# EAGLE design track charger (EAGLE 7.2.0)
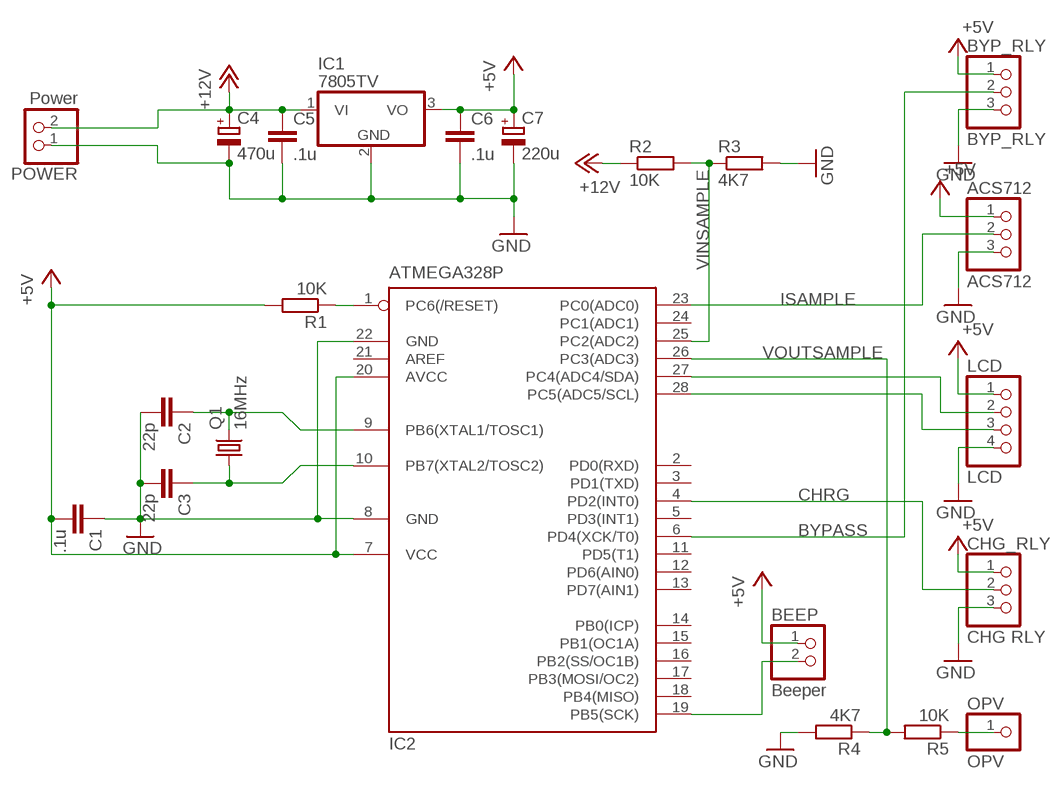
[diagram p0: schematic, sheet 1]

## Parts
ACS712  ACS712  PINHD-1X3  [1X03]
BEEP  Beeper  PINHD-1X2  [1X02]
BYP_RLY  BYP_RLY  PINHD-1X3  [1X03]
C1  .1u  C-EU025-024X044  [C025-024X044]
C2  22p  C-EU025-024X044  [C025-024X044]
C3  22p  C-EU025-024X044  [C025-024X044]
C4  470u  CPOL-EUE3.5-10  [E3,5-10]
C5  .1u  C-EU025-024X044  [C025-024X044]
C6  .1u  C-EU025-024X044  [C025-024X044]
C7  220u  CPOL-EUE2.5-7  [E2,5-7]
CHG_RLY  CHG RLY  PINHD-1X3  [1X03]
IC1  7805TV  [TO220V]
IC2  ATMEGA328P  MEGA8-P  [DIL28-3]
LCD  LCD  PINHD-1X4  [1X04]
OPV  OPV  PINHD-1X1  [1X01]
POWER  Power  PINHD-1X2  [1X02]
Q1  16MHz  CRYSTALHC18U-V  [HC18U-V]
R1  10K  R-EU_0204/7  [0204/7]
R2  10K  R-EU_0204/7  [0204/7]
R3  4K7  R-EU_0204/7  [0204/7]
R4  4K7  R-EU_0204/7  [0204/7]
R5  10K  R-EU_0204/7  [0204/7]

## Nets
+5V: ACS712.1 BEEP.1 BYP_RLY.1 C1.2 C6.1 C7.+ CHG_RLY.1 IC1.3(VO) IC2.7(VCC) IC2.20(AVCC) LCD.1 R1.2
+12V: C4.+ C5.1 IC1.1(VI) POWER.2 R2.1
BYPASS: BYP_RLY.2 IC2.6(PD4(XCK/T0))
CHRG: CHG_RLY.2 IC2.4(PD2(INT0))
GND: ACS712.3 BYP_RLY.3 C1.1 C2.2 C3.2 C4.- C5.2 C6.2 C7.- CHG_RLY.3 IC1.2(GND) IC2.8(GND) IC2.22(GND) LCD.4 POWER.1 R3.2 R4.2
ISAMPLE: ACS712.2 IC2.23(PC0(ADC0))
N$1: IC2.27(PC4(ADC4/SDA)) LCD.2
N$2: IC2.28(PC5(ADC5/SCL)) LCD.3
N$7: OPV.1 R5.1
N$10: C3.1 IC2.10(PB7(XTAL2/TOSC2)) Q1.1
N$13: BEEP.2 IC2.19(PB5(SCK))
N$16: C2.1 IC2.9(PB6(XTAL1/TOSC1)) Q1.2
N$18: IC2.1(PC6(/RESET)) R1.1
VINSAMPLE: IC2.25(PC2(ADC2)) R2.2 R3.1
VOUTSAMPLE: IC2.26(PC3(ADC3)) R4.1 R5.2
Unconnected: IC2.2(PD0(RXD)) IC2.3(PD1(TXD)) IC2.5(PD3(INT1)) IC2.11(PD5(T1)) IC2.12(PD6(AIN0)) IC2.13(PD7(AIN1)) IC2.14(PB0(ICP)) IC2.15(PB1(OC1A)) IC2.16(PB2(SS/OC1B)) IC2.17(PB3(MOSI/OC2)) IC2.18(PB4(MISO)) IC2.21(AREF) IC2.24(PC1(ADC1))

## Library data of the parts
ACS712 BYP_RLY CHG_RLY = pinhead:PINHD-1X3: PIN HEADER
BEEP POWER = pinhead:PINHD-1X2: PIN HEADER
C1-C3 C5 C6 = resistor:C-EU: CAPACITOR, European symbol
C4 C7 = resistor:CPOL-EU: POLARIZED CAPACITOR, European symbol
IC1 = linear:78*: Positive VOLTAGE REGULATOR Source: http://cache.national.com/ds/LM/LM78L05.pdf http://www.fairchildsemi.com/ds/LM/LM7805.pdf
IC2 = atmel:MEGA8-P: MICROCONTROLLER 8 Kbytes FLASH, 1 kbytes SRAM, 512 bytes EEPROM, USART, 4-channel 10 bit ADC, 2-channel 8 bit ADC Pin compatible with Atmega48, ATMega88, ATMega168 Source: avr.lbr; OC_FARNELL: unknown; OC_NEWARK: unknown
LCD = pinhead:PINHD-1X4: PIN HEADER
OPV = pinhead:PINHD-1X1: PIN HEADER
Q1 = crystal:CRYSTAL: CRYSTAL; OC_FARNELL: unknown; OC_NEWARK: unknown
R1-R5 = resistor:R-EU_: RESISTOR, European symbol

## Board
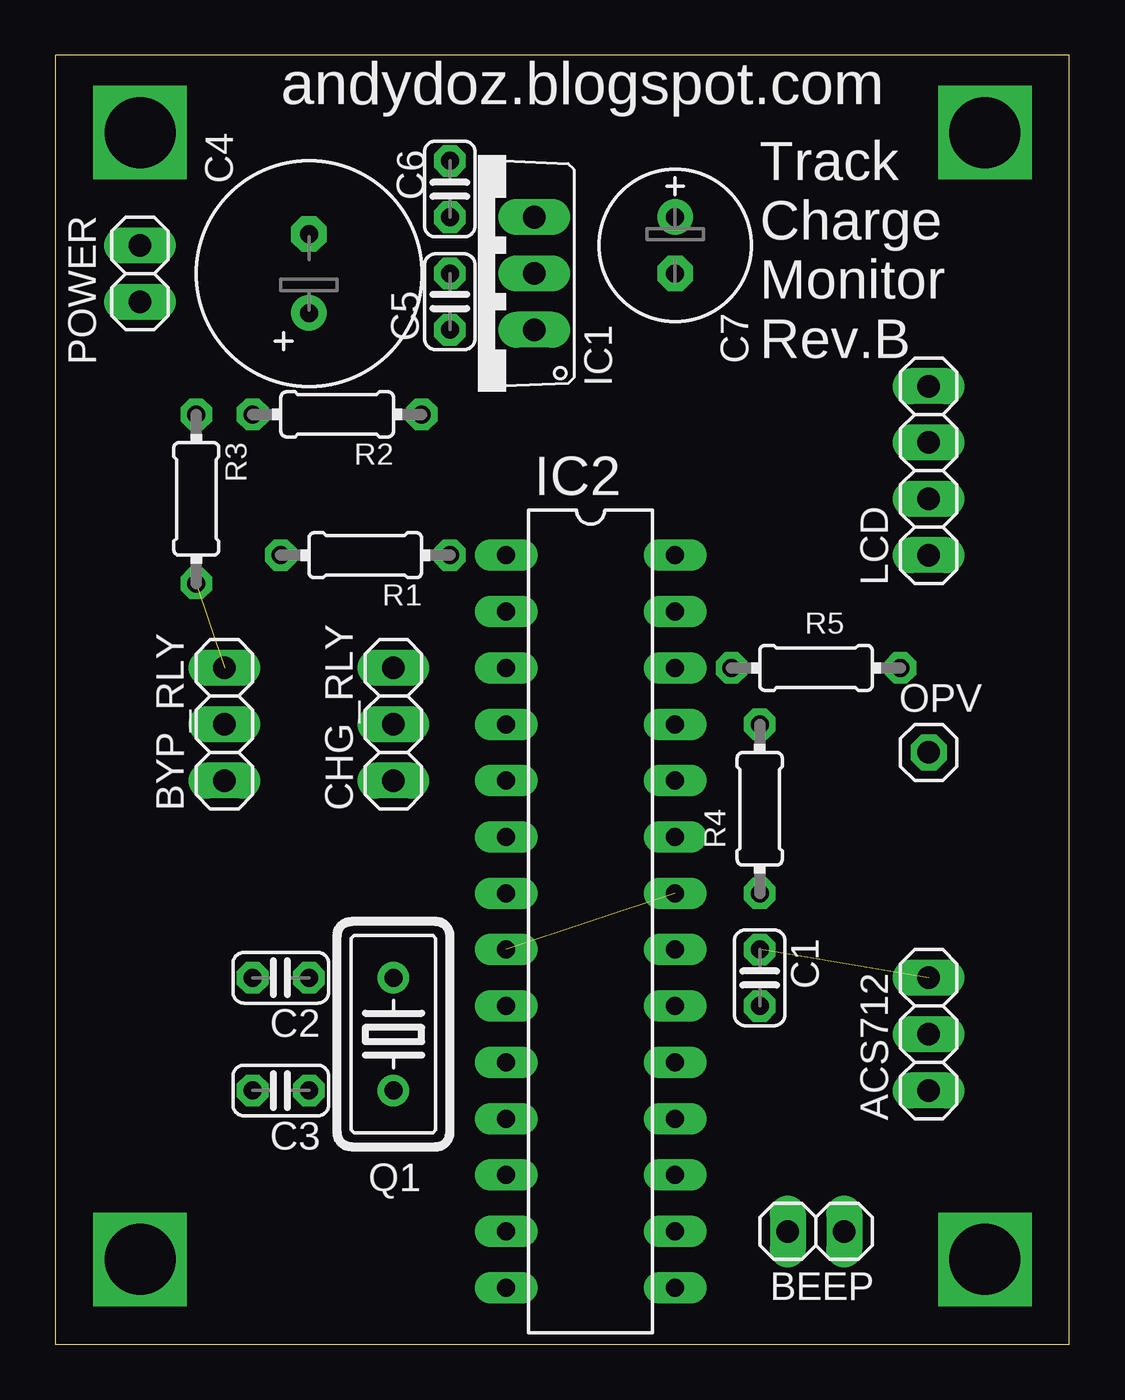
[diagram p1: board, top side]
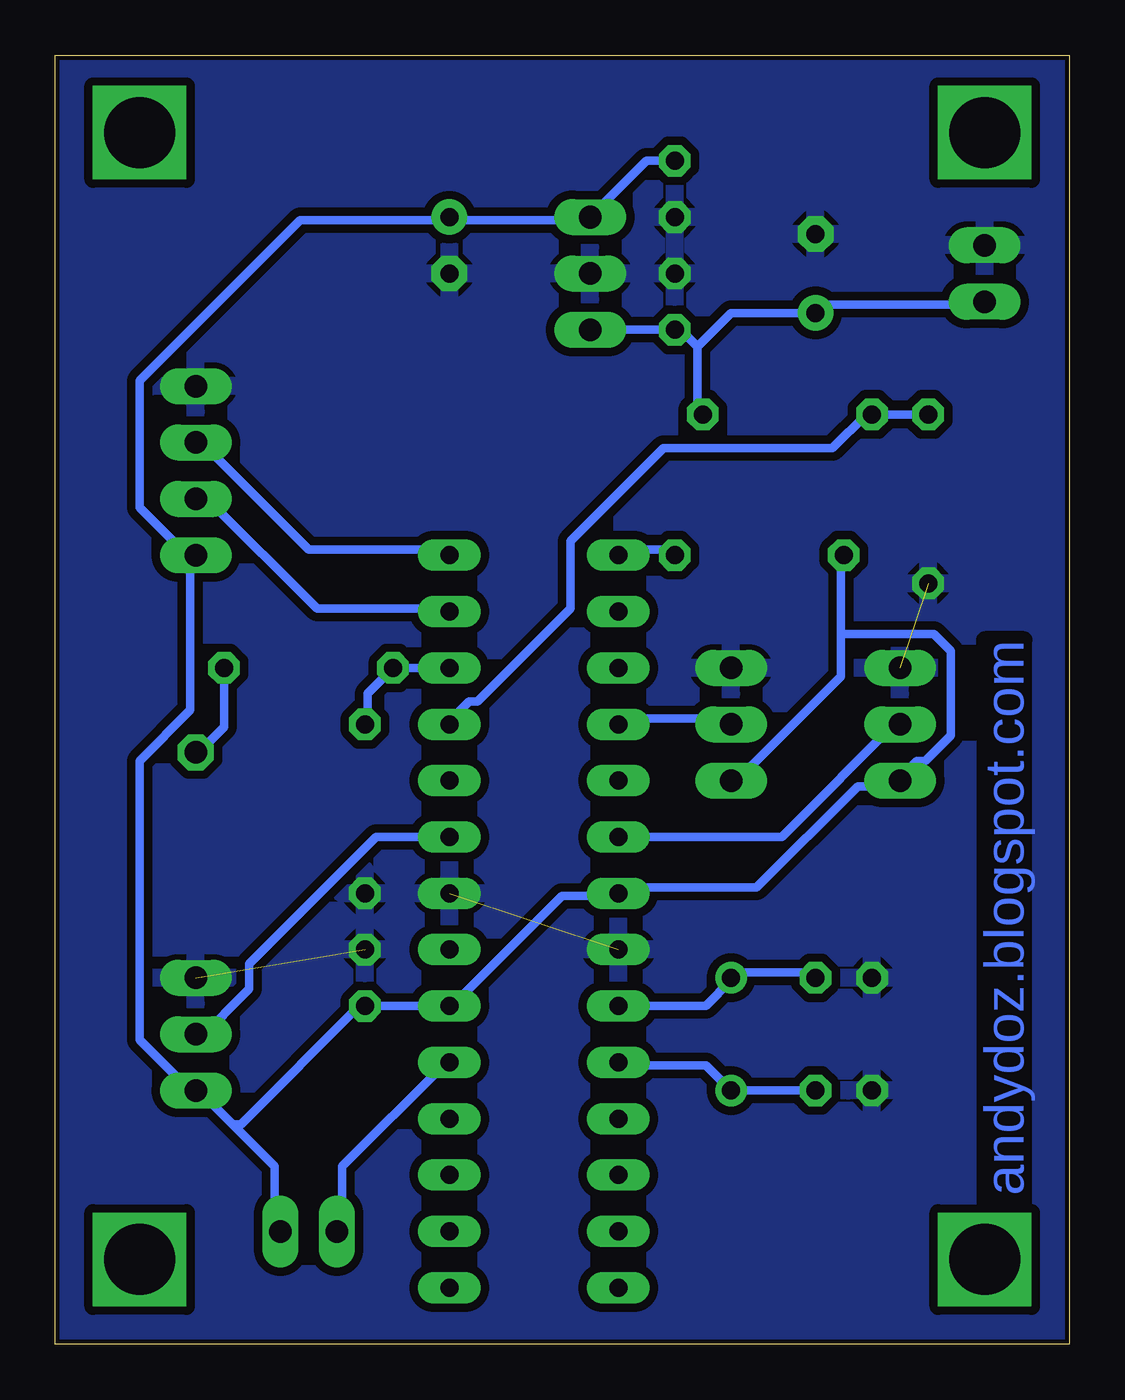
[diagram p2: board, bottom side, seen from below]

Size 45.7 x 58.09 mm. Coordinates in mm from the lower left corner, seen from the top.
Outline: 0,0 45.7,0 45.7,58.09 0,58.09 0,0
Copper layers (1*16): Top 0.035mm / dielectric 1.5mm / Bottom 0.035mm
Design rules "Doz1": minimum track width 15mil, minimum drill 20mil, track to track 15mil, track to pad 15mil, pad to pad 15mil, via to via 15mil, smd to smd 15mil, copper to edge 8mil, drill to drill 8mil, minimum pad ring 12mil, minimum via ring 10mil, stop-mask expansion 4mil, vias tented up to drill 20mil, thermal gap 10mil

### Footprints (pad centres in the part's own frame; a part is rotated, then mirrored left to right if it is on the bottom)
1X03 = drill 1.016 long: 1 -2.54,0; 2 0,0; 3 2.54,0
1X02 = drill 1.016 long: 1 -1.27,0; 2 1.27,0
C025-024X044 = drill 0.813 octagon: 1 -1.27,0; 2 1.27,0
E3,5-10 = drill 0.813 pad 1.6: + -1.778,0 | drill 0.813 pad 1.6 octagon: - 1.778,0
E2,5-7 = drill 0.813 pad 1.6: + -1.27,0 | drill 0.813 pad 1.6 octagon: - 1.27,0
TO220V = drill 1.016 long: 1 -2.54,-2.54; 2 0,-2.54; 3 2.54,-2.54
DIL28-3 = drill 0.813 long: 1 -16.51,-3.81; 2 -13.97,-3.81; 3 -11.43,-3.81; 4 -8.89,-3.81; 5 -6.35,-3.81; 6 -3.81,-3.81; 7 -1.27,-3.81; 8 1.27,-3.81; 9 3.81,-3.81; 10 6.35,-3.81; 11 8.89,-3.81; 12 11.43,-3.81; 13 13.97,-3.81; 14 16.51,-3.81; 15 16.51,3.81; 16 13.97,3.81; 17 11.43,3.81; 18 8.89,3.81; 19 6.35,3.81; 20 3.81,3.81; 21 1.27,3.81; 22 -1.27,3.81; 23 -3.81,3.81; 24 -6.35,3.81; 25 -8.89,3.81; 26 -11.43,3.81; 27 -13.97,3.81; 28 -16.51,3.81
1X04 = drill 1.016 long: 1 -3.81,0; 2 -1.27,0; 3 1.27,0; 4 3.81,0
1X01 = drill 1.016 octagon: 1 0,0
HC18U-V = drill 0.813: 1 -2.54,0; 2 2.54,0
0204/7 = drill 0.813 octagon: 1 -3.81,0; 2 3.81,0

### Placement (x,y rotation side)
ACS712  39.37,13.97 90 top
BEEP  34.29,5.08 180 top
BYP_RLY  7.62,27.94 90 top
C1  31.75,16.51 270 top
C2  10.16,16.51 180 top
C3  10.16,11.43 180 top
C4  11.43,48.26 90 top
C5  17.78,46.99 90 top
C6  17.78,52.07 270 top
C7  27.94,49.53 270 top
CHG_RLY  15.24,27.94 90 top
IC1  19.05,48.26 90 top
IC2  24.13,19.05 270 top
LCD  39.37,39.37 90 top
OPV  39.37,26.67 0 top
POWER  3.81,48.26 270 top
Q1  15.24,13.97 90 top
R1  13.97,35.56 180 top
R2  12.7,41.91 180 top
R3  6.35,38.1 270 top
R4  31.75,24.13 270 top
R5  34.29,30.48 180 top

### Tracks (layer width: path | path; a pad name or v marks a point on that pad's centre or on a via)
+5V
  Bottom 0.381: 10.29,32 10.29,30.1 15.24,25.15 CHG_RLY.1 | 10.29,32 10.29,35.43 R1.2 | 10.29,32 6.1,32 5.33,31.24 5.33,27.43 6.48,26.29 6.86,26.29 7.62,25.53 BYP_RLY.1 7.62,25.15 9.53,25.15 14.1,20.57 20.19,20.57 IC2.7 20.57,20.19 22.86,20.19 27.81,15.24 IC2.20 C1.2 32,15.24 37.34,9.91 37.72,9.91 | C6.1 19.05,53.34 IC1.3 21.72,50.67 27.81,50.67 C7.+ 28.19,50.67 34.67,50.67 41.91,43.43 41.91,37.72 39.62,35.43 | 37.72,9.91 39.24,11.43 ACS712.1 39.62,11.43 41.91,13.72 41.91,26.29 39.62,28.58 39.62,35.43 | 37.72,9.91 35.81,8 35.81,5.33 BEEP.1 | 39.62,35.43 LCD.1
+12V
  Bottom 0.381: 16.76,44.96 16.76,41.91 R2.1 | 16.76,44.96 17.53,45.72 C5.1 IC1.1 | 16.76,44.96 15.24,46.48 C4.+ 11.05,46.86 3.81,46.86 POWER.2
BYPASS
  Bottom 0.381: IC2.6 12.95,22.86 7.62,28.19 BYP_RLY.2
CHRG
  Bottom 0.381: IC2.4 20.19,28.19 15.24,28.19 CHG_RLY.2
GND  (3 unrouted)
  pour Bottom: 0,58.42 45.72,58.42 45.72,0 0,0
ISAMPLE
  Bottom 0.381: IC2.23 31.24,22.86 36.96,17.15 36.96,16 39.24,13.72 ACS712.2
N$1
  Bottom 0.381: LCD.2 38.86,38.1 33.91,33.15 28.19,33.15 IC2.27
N$2
  Bottom 0.381: IC2.28 28.19,35.81 34.29,35.81 39.24,40.77 LCD.3
N$7
  Bottom 0.381: R5.1 38.1,27.81 39.24,26.67 OPV.1
N$8  (via drill 3.2)
  other vias: 3.81,54.61
N$9  (via drill 3.2)
  other vias: 41.91,54.61
N$10
  Bottom 0.381: C3.1 Q1.1 16.38,12.57 20.19,12.57 IC2.10
N$11  (via drill 3.2)
  other vias: 41.91,3.81
N$12  (via drill 3.2)
  other vias: 3.81,3.81
N$13
  Bottom 0.381: IC2.19 28.19,12.57 32.77,8 32.77,5.33 BEEP.2
N$16
  Bottom 0.381: C2.1 11.43,16.76 15.24,16.76 Q1.2 15.24,16.38 16.38,15.24 IC2.9
N$18
  Bottom 0.381: R1.1 17.91,35.81 20.19,35.81 IC2.1
VINSAMPLE
  Bottom 0.381: R3.1 R2.2 9.14,41.91 10.67,40.39 18.29,40.39 22.48,36.2 22.48,33.15 26.67,28.96 27.05,28.96 27.81,28.19 IC2.25
VOUTSAMPLE
  Bottom 0.381: R4.1 31.62,28.19 31.62,29.34 R5.2 IC2.26

### Text on the board
Bottom: andydoz.blogspot.com
tPlace: andydoz.blogspot.com | Track / Charge / Monitor / Rev.B